# EAGLE design tiny servo controller (EAGLE 5.07)
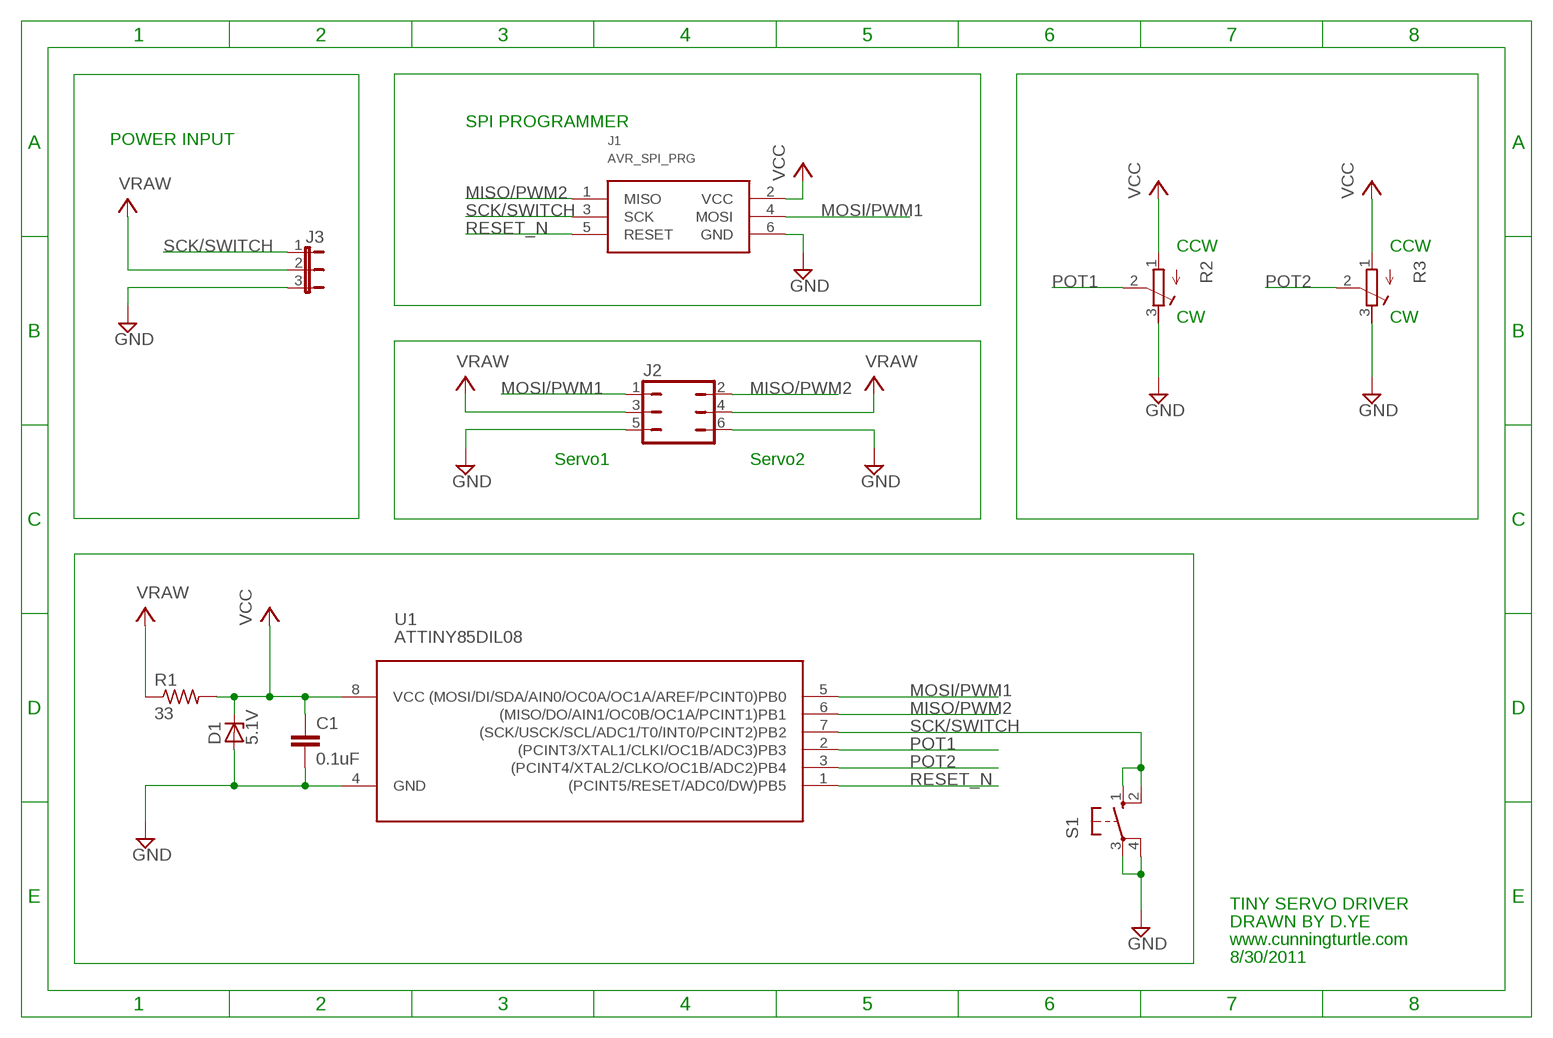
[diagram p0: schematic, sheet 1]

## Parts
C1  0.1uF  C-EU025-024X044  [C025-024X044]
D1  5.1V  ZENER-DIODEDO35Z10  [DO35Z10]
J1  AVR_SPI_PRG  [AVR_ISP_6P]
J2  JP3Q  [JP3Q]
J3  JP2E  [JP2]
R1  33  R-US_0207/7  [0207/7]
R2  R-TRIMMCT2265  [CT2265-ND]
R3  R-TRIMMCT2265  [CT2265-ND]
S1  TACTILE_6MM  [TACTILE_6MM]
U1  ATTINY85DIL08  [DIL08]

## Nets
GND: C1.2 D1.A J1.6(GND) J2.5 J2.6 J3.3 R2.3(A) R3.3(A) S1.3(P) S1.4(P1) U1.4(GND)
MISO/PWM2: J1.1(MISO) J2.2 U1.6((MISO/DO/AIN1/OC0B/OC1A/PCINT1)PB1)
MOSI/PWM1: J1.4(MOSI) J2.1 U1.5((MOSI/DI/SDA/AIN0/OC0A/OC1A/AREF/PCINT0)PB0)
POT1: R2.2(S) U1.2((PCINT3/XTAL1/CLKI/OC1B/ADC3)PB3)
POT2: R3.2(S) U1.3((PCINT4/XTAL2/CLKO/OC1B/ADC2)PB4)
RESET_N: J1.5(RESET) U1.1((PCINT5/RESET/ADC0/DW)PB5)
SCK/SWITCH: J1.3(SCK) J3.1 S1.1(S) S1.2(S1) U1.7((SCK/USCK/SCL/ADC1/T0/INT0/PCINT2)PB2)
V+: J2.3 J2.4 J3.2 R1.1 ; supply symbol labelled VRAW
VCC: C1.1 D1.C J1.2(VCC) R1.2 R2.1(E) R3.1(E) U1.8(VCC)

## Notes on the sheet
- SPI PROGRAMMER
- POWER INPUT
- CCW | CCW
- CW | CW
- Servo1 | Servo2
- TINY SERVO DRIVER
- DRAWN BY D.YE
- www.cunningturtle.com
- 8/30/2011

## Library data of the parts
C1 = resistor:C-EU: CAPACITOR, European symbol
D1 = diode:ZENER-DIODE: Z-Diode
J1 = CunningTurtle:AVR_SPI_PRG: AVR ISP 6 Pin
J2 = jumper:JP3Q: JUMPER
J3 = jumper:JP2E: JUMPER
R1 = resistor:R-US_: RESISTOR, American symbol
R2 R3 = resistor:R-TRIMM: Trimm resistor
S1 = CunningTurtle:TACTILE_6MM: Tactile SWITCH 6mm
U1 = CunningTurtle:ATTINY85: ATTINY25/45/85

## Board
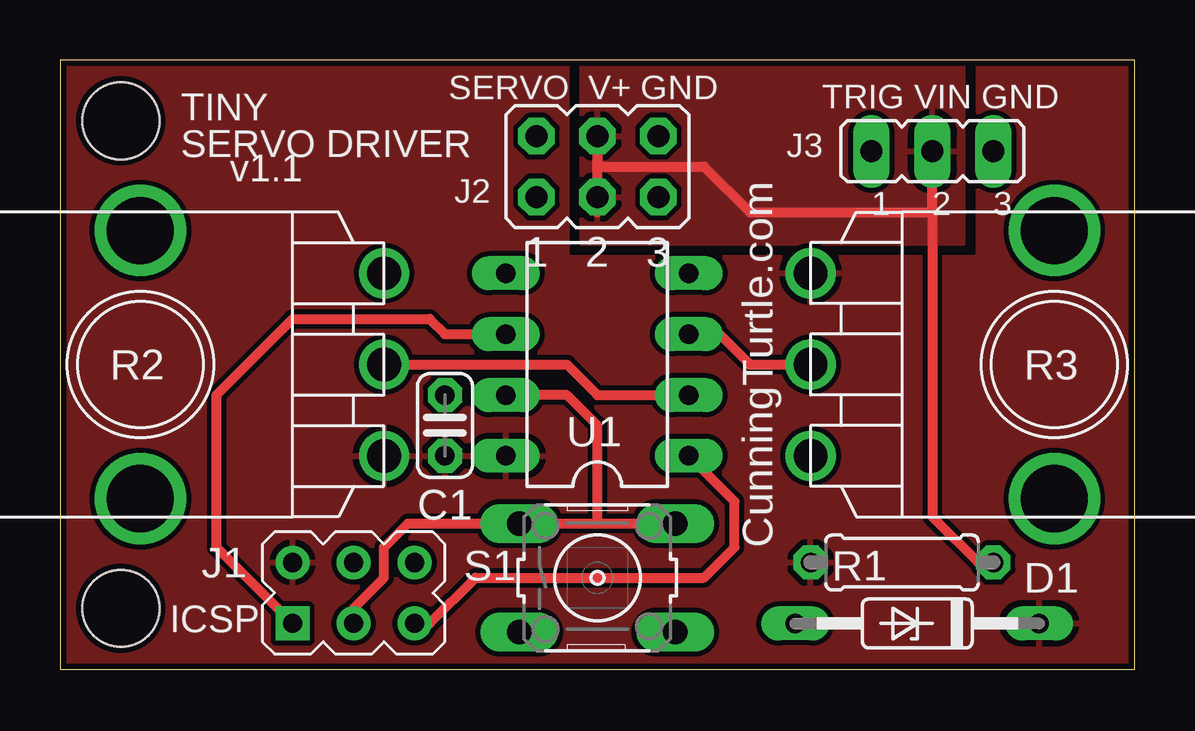
[diagram p1: board, top side]
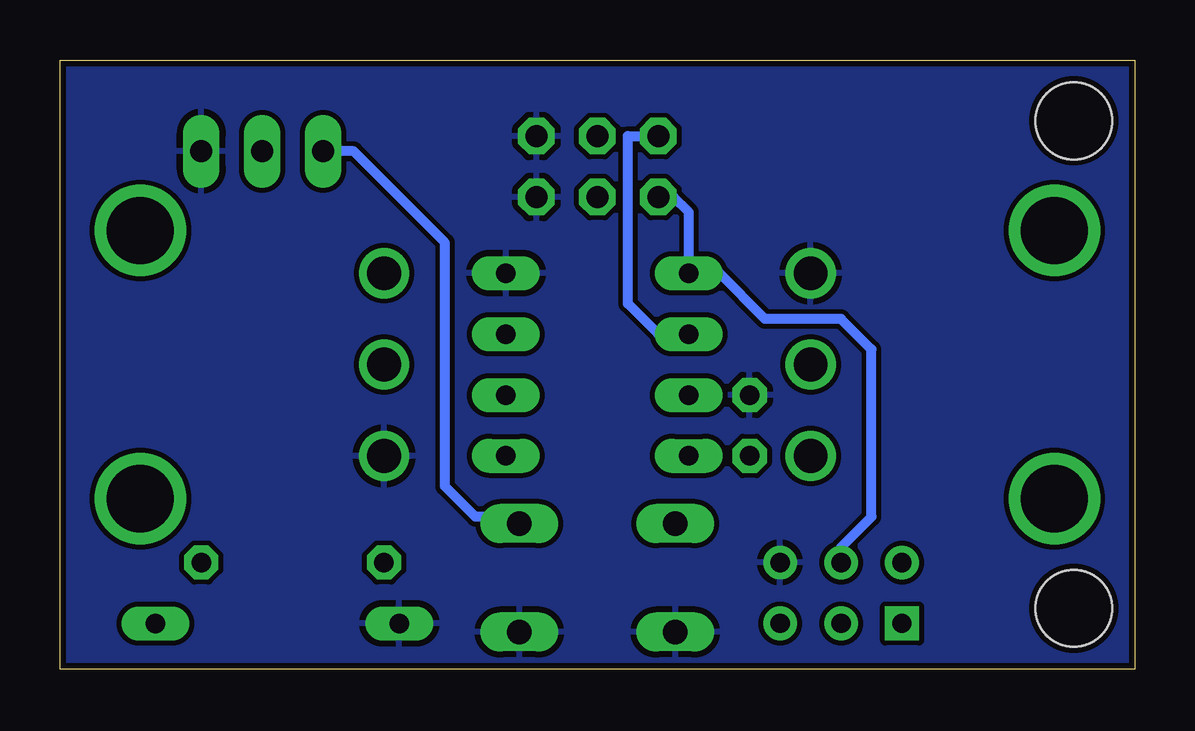
[diagram p2: board, bottom side, seen from below]

Size 44.8 x 25.4 mm. Coordinates in mm from the lower left corner, seen from the top.
Outline: 0,0 44.8,0 44.8,25.4 0,25.4 0,0
Copper layers (1*16): Top 0.035mm / dielectric 1.5mm / Bottom 0.035mm
Design rules "default": minimum track width 8mil, minimum drill 20mil, track to track 8mil, track to pad 8mil, pad to pad 8mil, via to via 8mil, smd to smd 8mil, copper to edge 10mil, drill to drill 8mil, minimum pad ring 12mil, minimum via ring 10mil, stop-mask expansion 4mil, vias tented up to drill 25mil, thermal gap 10mil
Holes 3.2 mm at 2.54,2.54 2.54,22.86

### Footprints (pad centres in the part's own frame; a part is rotated, then mirrored left to right if it is on the bottom)
C025-024X044 = drill 0.813 octagon: 1 -1.27,0; 2 1.27,0
DO35Z10 = drill 0.813 long: A 5.08,0; C -5.08,0
AVR_ISP_6P = drill 0.8 square: 1 -2.54,-1.27 | drill 0.8: 2 -2.54,1.27; 3 0,-1.27; 4 0,1.27; 5 2.54,-1.27; 6 2.54,1.27
JP3Q = drill 0.914 octagon: 1 -2.54,-1.27; 2 -2.54,1.27; 3 0,-1.27; 4 0,1.27; 5 2.54,-1.27; 6 2.54,1.27
JP2 = drill 0.914 long: 1 -2.54,0; 2 0,0; 3 2.54,0
0207/7 = drill 0.813 octagon: 1 -3.81,0; 2 3.81,0
CT2265-ND = drill 1.4: 1 -10.16,3.81; 2 -10.16,0; 3 -10.16,-3.81 | drill 2.8: 4 0,5.588; 5 0,-5.588
TACTILE_6MM = drill 1.016 long: 1 -3.251,2.261; 2 3.251,2.261; 3 -3.251,-2.261; 4 3.251,-2.261
DIL08 = drill 0.813 long: 1 -3.81,-3.81; 2 -1.27,-3.81; 3 1.27,-3.81; 4 3.81,-3.81; 5 3.81,3.81; 6 1.27,3.81; 7 -1.27,3.81; 8 -3.81,3.81

### Placement (x,y rotation side)
C1  16.05,10.16 90 top
D1  35.73,1.91 180 top
J1  12.24,3.17 0 top
J2  22.4,20.95 0 top
J3  36.37,21.59 0 top
R1  35.1,4.45 180 top
R2  3.35,12.7 180 top
R3  41.45,12.7 0 top
S1  22.4,3.81 0 top
U1  22.4,12.7 90 top

### Tracks (layer width: path | path; a pad name or v marks a point on that pad's centre or on a via)
GND
  pour Bottom: 0,25.4 0,0 44.8,0 44.8,25.4
MISO/PWM2
  Top 0.406: J1.1 6.53,5.08 6.53,11.43 9.7,14.61 15.42,14.61 16.05,13.97 U1.6
  Bottom 0.406: J2.2 21.13,22.23 21.13,15.24 19.86,13.97 U1.6
MOSI/PWM1
  Bottom 0.406: J1.4 12.24,5.08 10.97,6.35 10.97,13.34 12.24,14.61 15.42,14.61 17.32,16.51 U1.5 18.59,19.05 19.23,19.68 J2.1
POT1
  Top 0.406: R2.2 21.13,12.7 22.4,11.43 U1.2
POT2
  Top 0.406: U1.3 27.48,13.97 28.75,12.7 R3.2
RESET_N
  Top 0.406: J1.5 15.42,1.91 17.32,3.81 26.85,3.81 28.12,5.08 28.12,6.99 U1.1
SCK/SWITCH
  Top 0.406: 22.4,6.07 S1.1 14.5,6.07 13.51,5.08 13.51,3.81 12.24,2.54 J1.3 | 22.4,6.07 S1.2 | U1.7 21.13,11.43 22.4,10.16 22.4,6.07
  Bottom 0.406: J3.1 32.56,21.59 28.75,17.78 28.75,7.62 27.48,6.35 25.93,6.35 S1.2
V+
  Top 0.406: 36.37,19.05 36.37,6.35 38.28,4.45 R1.1 | 36.37,19.05 J3.2 | J2.3 J2.4 22.4,20.95 | 22.4,19.05 22.4,20.95 | 22.4,20.95 26.85,20.95 28.75,19.05 36.37,19.05
  pour Top: 21.77,25.4 21.77,17.78 37.64,17.78 37.64,25.4
VCC
  pour Top: 0,25.4 0,0 44.8,0 44.8,25.4 38.27,25.4 38.27,17.14 21.13,17.14 21.13,25.4

### Text on the board
tPlace: SERVO V+ GND | TINY | TRIG VIN GND | SERVO DRIVER | v1.1 | CunningTurtle.com | ICSP